# Altium project Dual PMT Controller - Light Interlock.PrjPcb
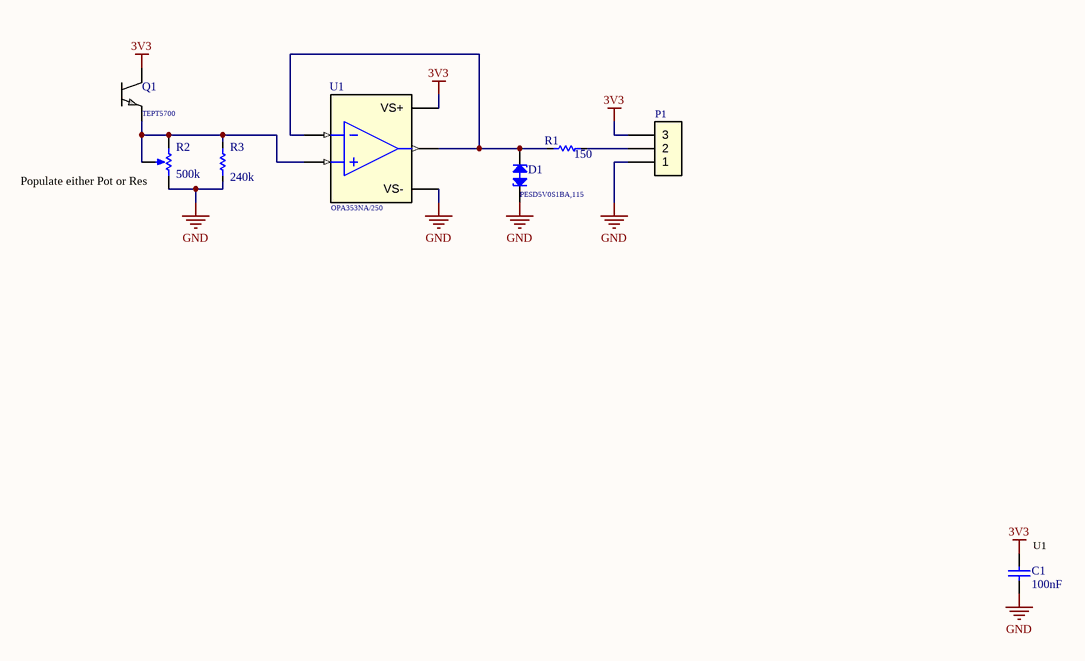
[diagram p0: Dual PMT Controller - Light Interlock.SchDoc]
Project: Dual PMT Controller
1 sheet, 8 parts. Net scope: global (net labels, ports and power ports of the same name join across sheets).
Board file: Dual PMT Controller - Light Interlock.PcbDoc

## Sheet Dual PMT Controller - Light Interlock.SchDoc
size 297 x 209 mm; Revision: 1; SheetNumber: 1; SheetTotal: 1; swcgroup: FabLabs; Org: Sainsbury Wellcome Centre; Add1: 25 Howland Street; Add2: London; Add3: W1T 4JG; WebAddress: www.sainsburywellcome.org; SheetSize: A4; SheetName: Dual PMT Controller - Light Interlock

### Parts
C1  value 100nF  [FP-GRM188-0_1-e0_2_0_5-IPC_B]  (hidden comment: C0603-100nF-100V-10%-X7R)
D1  PESD5V0S1BA,115  [FP-SOD323-CA-IPC_B]
P1  Header-103  [Header-103]  (value not drawn)
Q1  TEPT5700  [LED_TEPT5700_VIS]
R1  value 150  [FP-CPF0603-IPC_B]  (hidden comment: R0603-150R-1/16W-0.1%)
R2  value 500k  [SM-42TAxxx_NDC]  (hidden comment: SM-42TA504)
R3  value 240k  [FP-CPF0603-IPC_B]  (hidden comment: R0603-240k-1/16W-0.1%)
U1  OPA353NA/250  [DBV0005A_N]

### Nets
3V3: C1.2 P1.3 Q1.1(C) U1.5(VS+)
GND: C1.1 D1.1(K1) P1.1 R2.3(BOT) R3.1 U1.2(VS-)
NetD1_2: D1.2(K2) R1.1 U1.1(OUT) U1.4(IN-)
NetP1_2: P1.2 R1.2
NetQ1_2: Q1.2(E) R2.1(TOP) R2.2(TAP) R3.2 U1.3(IN+)

### Notes on the sheet
- (near R2) Populate either Pot or Res
- (near C1) U1
- FILE
- VARIANT
- DATE
- REVISION
- SHEET
- /
- PROJECT
- SIZE

### Library data of the parts
C1 = CMP-611-0027-19: 0.1µF ±10% 100V Ceramic Capacitor X7R 0603 (1608 Metric); Pick&PlaceFootprint: 0603_CAP; Mount: Surface Mount; Voltage Rating: 100V; Min Operating Temperature: -55°C; Termination: SMD/SMT; Width: 0.8mm; Series: GRM; Packaging: Tape and Reel; Size: 0.8mm; Case Code (Metric): 1608; REACH SVHC: No SVHC; Case/Package: 0603; Construction: Flat; Dielectric: X7R; Weight: 0.000222oz; Height: 0.8mm; Tolerance: 10%; Package Quantity: 1; Lead Free: Lead Free; Voltage: 100V; RoHS Compliant: Yes; Capacitance: 100nF; Thickness: 0.035inch; Radiation Hardening: No; Depth: 0.8mm; Length: 1.6mm; Max Operating Temperature: 125°C; Material: Ceramic; Case Code (Imperial): 0603; Voltage Rating (DC): 100V; RoHS: Yes; Capacitor Type: Ceramic
D1 = CMP-820-0001-1: Trans Voltage Suppressor Diode, 130W, 5V V(RWM), Bidirectional, 1 Element, Silicon; Time @ Peak Reflow Temperature-Max (s): 30s; Min Breakdown Voltage: 5.5V; Max Breakdown Voltage: 9.5V; Reference Standard: IEC-60134; Number of Elements: 1; Package Body Material: Plastic; Pick&PlaceFootprint: SOD323; Package Shape: Rectangular; Peak Reflow Temperature (Cel): 260°C; REACH SVHC: Yes; Number of Pins: 2; Terminal Form: Gull Wing; Moisture Sensitivity Level: 1; Non-rep Peak Rev Power Dis-Max: 130W; JESD-609 Code: e3; Terminal Finish: Tin; PartNumber: PESD5V0S1BA,115; RoHS Compliant: Yes; Diode Element Material: SILICON; Rep Pk Reverse Voltage-Max: 5V; Surface Mount: Yes; Terminal Position: DUAL; Mount: Surface Mount; Max Operating Temperature: 150°C; Polarity: Bidirectional; Diode Type: TRANS VOLTAGE SUPPRESSOR; Technology: AVALANCHE; Package Style: SMALL OUTLINEMeter; JESD-30 Code: R-PDSO-G2
P1 = CMP-370-0045-1: 0.1" spaced holes to solder wires into; Pitch: 0.1"; Mount: Surface Mount; PartNumber: Header-103
Q1 = CMP-540-0000-1: Ambient Light Sensor Phototransistor Chip Silicon 570nm 2-Pin T-1 3/4; Number of Channels: 1; Polarity: NPN; Lens Style: Flat; Collector Emitter Breakdown Voltage: 6V; Viewing Angle: 50°; Dark Current: 50nA; Power Consumption: 100mW; Output Type: Analog; Max Collector Current: 20mA; Operating Supply Voltage: 5V; Height: 5mm; Wavelength: 570nm; Case/Package: Radial; Width: 5.7mm; Package Quantity: 4000; Number of Elements: 1; Max Operating Temperature: 85°C; Packaging: Bulk; Mount: Through Hole; Series: -; Max Power Dissipation: 100mW; Min Operating Temperature: -40°C; Number of Pins: 2; Length: 5.7mm; RoHS Compliant: Yes; Power Dissipation: 100mW; Radiation Hardening: No; Collector Emitter Voltage (VCEO): 6V; Lead Free: Lead Free; REACH SVHC: Unknown
R1 = CMP-633-0078-2: Surface Mount Resistor 150 Ohm 1/16 W 0.1% 0603 (1608 Metric); Voltage Rating: 50V; Max Power Dissipation: 62.5 mW; Power Rating: 62.5mW; Number of Resistors: 1; Temperature Coefficient: 25ppm/°C; Pick&PlaceFootprint: R0603; Size Code: 0603; Width: 0.8mm; Number of Pins: 2; Tolerance: 0.1%; Resistance: 150; Construction: Chip; Voltage Rating (DC): 50V; Resistor Type: FIXED RESISTOR; Number of Terminations: 2; Weight: 7.1E-05oz; Min Operating Temperature: -55°C; Length: 1.6mm; Case/Package: 0603; Packaging: Tape and Reel; REACH SVHC: Yes; Height: 0.45mm; Mount: Surface Mount; RoHS Compliant: Yes; ELV: Compliant; Case Code (Metric): 1608; Termination: Wraparound; RoHS: Yes; Case Code (Imperial): 0603; Max Operating Temperature: 155°C; Composition: Thin Film; Resistance Tolerance: 0.1%; Series: CPF; Technology: THIN FILM
R2 = CMP-632-0001-2: Trimmer, Cermet, 0.25W, 500k ohm, 300V, 10% +/-Tol, 100ppm/Cel, 11 Turn(s), 1918; Power Rating: 250mW; Number of Turns: 11; PartNumber: SM-42TA504; Resistance: 500k; RoHS: Yes; Voltage Rating: 300V; Case/Package: SM-42TA; Pick&PlaceFootprint: SM-42TA; Mount: SMD; Tolerance: 10%
R3 = CMP-633-0073-14: Surface Mount Resistor 240k Ohm 1/16 W 0.1% 0603 (1608 Metric); Voltage Rating: 50V; Power Rating: 62.5mW; Number of Resistors: 1; Temperature Coefficient: 25ppm/°C; Max Power Dissipation: 62.5 mW; Pick&PlaceFootprint: R0603; Max Operating Temperature: 155°C; Min Operating Temperature: -55°C; REACH SVHC: No SVHC; Number of Terminations: 2; Weight: 7.1E-05oz; RoHS Compliant: Yes; Case Code (Metric): 1608; Case/Package: 0603; Tolerance: 0.1%; Width: 0.8mm; Packaging: Tape and Reel; Resistance Tolerance: 0.1%; Termination: Solder; Composition: Thin Film; Resistor Type: Thin Film; Voltage Rating (DC): 50V; Case Code (Imperial): 0603; Series: CPF; Height: 0.45mm; Mount: Surface Mount; Length: 1.6mm; RoHS: Yes; Number of Pins: 2; Resistance: 240k; ELV: Compliant; Size Code: 0603; Technology: Thin Film
U1 = CMP-941-0005-3: Operational Amplifier, 1 Func, 8000uV Offset-Max, CMOS, PDSO5; Pick&PlaceFootprint: SOT-23-5; PartNumber: OPA353NA/250; Component Name: OPA353NA/250